# EAGLE design Dimmer2_RevA (EAGLE 7.4.0)
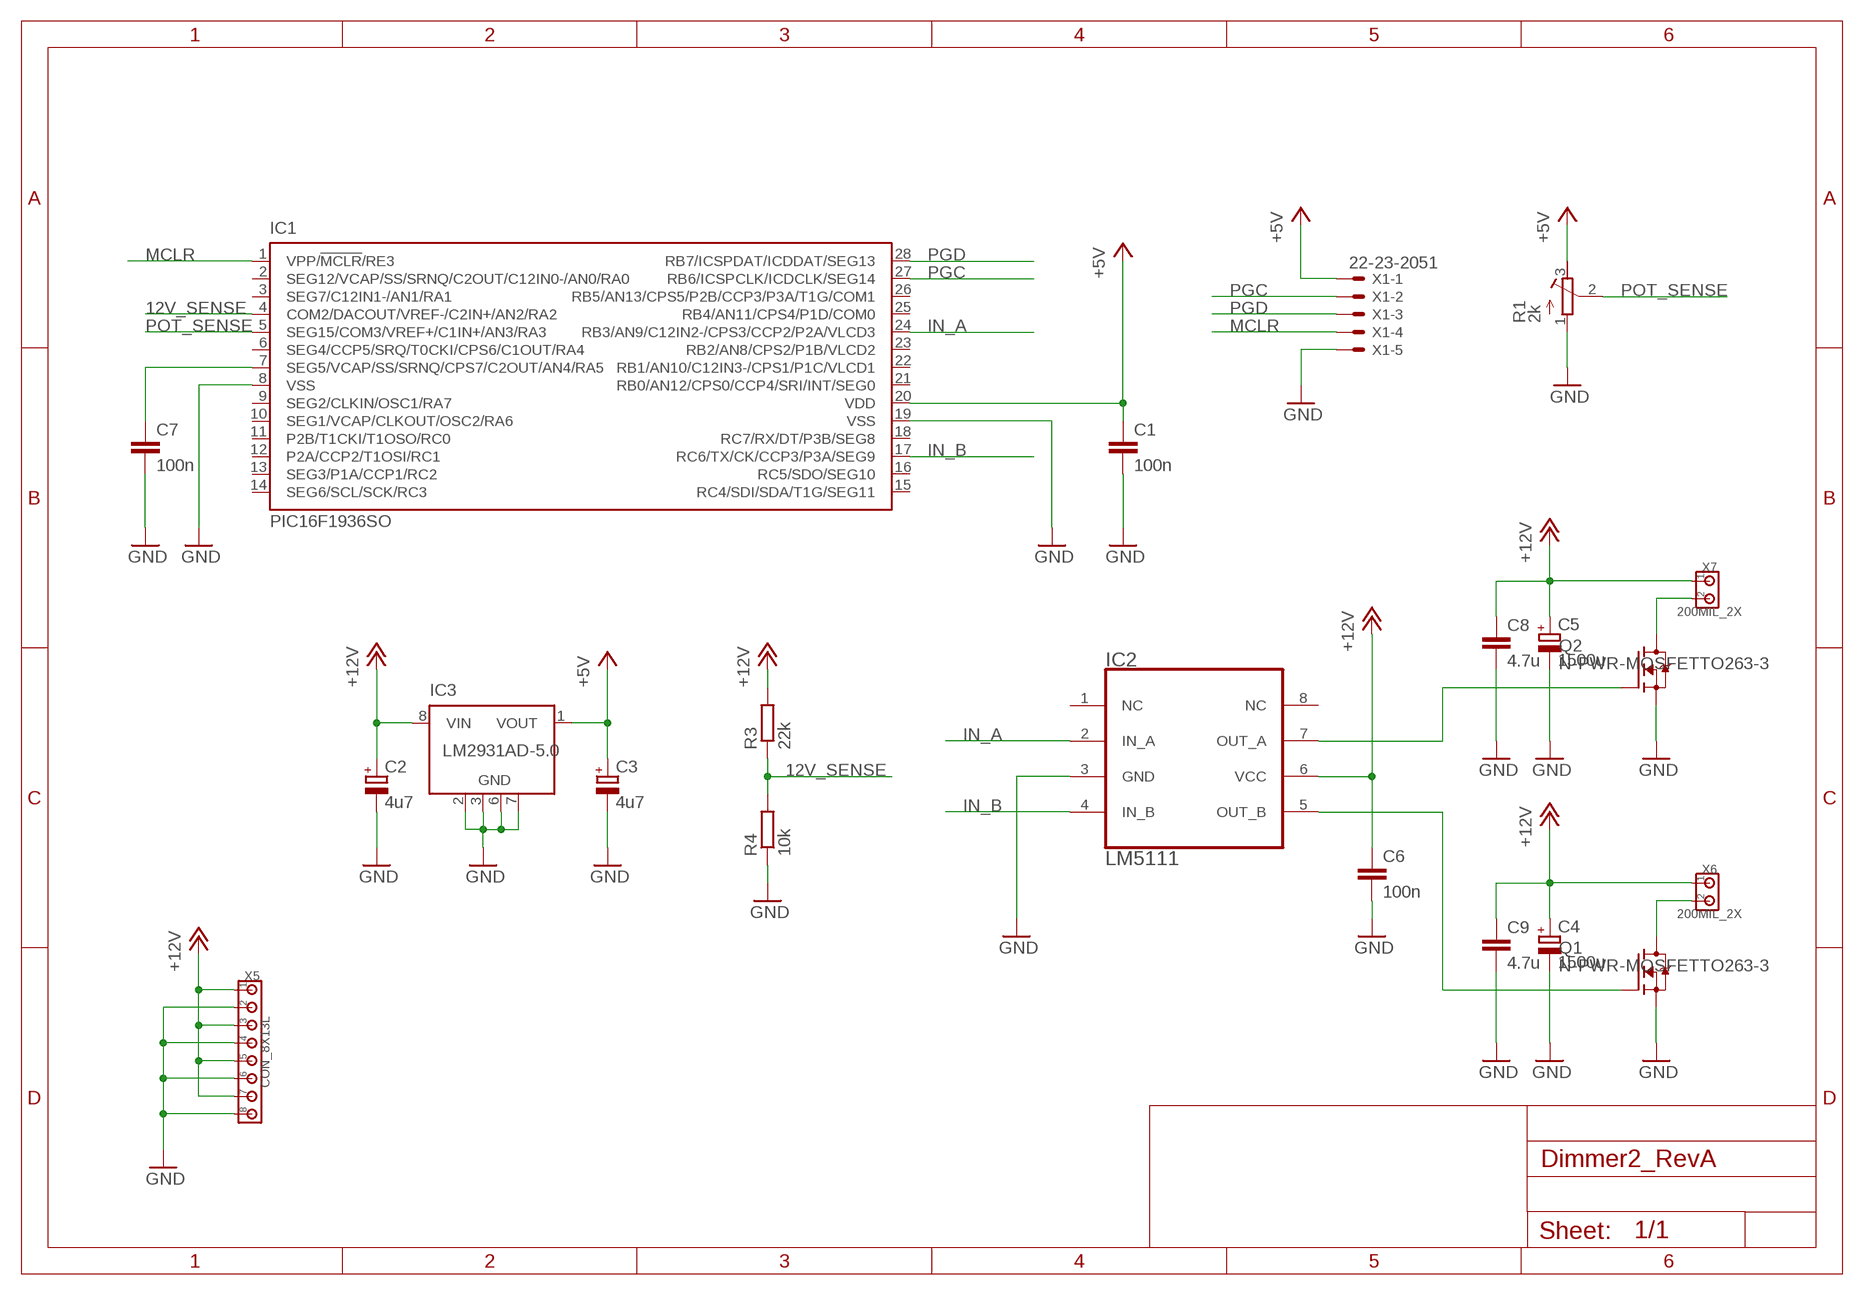
[diagram p0: schematic, sheet 1]

## Parts
C1  100n  CC0805  [C0805]
C2  4u7  C_POLARIZEDSMC_C  [SMC_C]
C3  4u7  C_POLARIZEDSMC_C  [SMC_C]
C4  1500u  C_POLARIZED10MM  [10MM]
C5  1500u  C_POLARIZED10MM  [10MM]
C6  100n  CC0805  [C0805]
C7  100n  CC0805  [C0805]
C8  4.7u  CC1206  [C1206]
C9  4.7u  CC1206  [C1206]
IC1  PIC16F1936SO  [SO28W]
IC2  LM5111  [SOIC8]
IC3  LM2931AD-5.0  [SO8]
Q1  N-PWR-MOSFETTO263-3  [TO263-3]
Q2  N-PWR-MOSFETTO263-3  [TO263-3]
R1  2k  TRIMMER  [CONTELEC]
R3  22k  RESISTORR0805  [R0805]
R4  10k  RESISTORR0805  [R0805]
X1  22-23-2051  [22-23-2051]
X5  CON_8X13L  [200MIL_8X]
X6  200MIL_2X  [200MIL_2X]
X7  200MIL_2X  [200MIL_2X]

## Nets
12V_SENSE: IC1.4(COM2/DACOUT/VREF-/C2IN+/AN2/RA2) R3.1 R4.2
+5V: C1.1 C3.+ IC1.20(VDD) IC3.1(VOUT) R1.3(CW) X1.1
+12V: C2.+ C4.+ C5.+ C6.1 C8.1 C9.1 IC2.6(VCC) IC3.8(VIN) R3.2 X5.1 X5.3 X5.5 X5.7 X6.1 X7.1
GND: C1.2 C2.- C3.- C4.- C5.- C6.2 C7.2 C8.2 C9.2 IC1.8(VSS) IC1.19(VSS) IC2.3(GND) IC3.2(GND) IC3.3(GND) IC3.6(GND) IC3.7(GND) Q1.3(S) Q2.3(S) R1.1(CCW) R4.1 X1.5 X5.2 X5.4 X5.6 X5.8
IN_A: IC1.24(RB3/AN9/C12IN2-/CPS3/CCP2/P2A/VLCD3) IC2.2(IN_A)
IN_B: IC1.17(RC6/TX/CK/CCP3/P3A/SEG9) IC2.4(IN_B)
MCLR: IC1.1(VPP/!MCLR!/RE3) X1.4
N$1: IC2.5(OUT_B) Q1.1(G)
N$2: Q1.TAB(D) X6.2
N$4: Q2.TAB(D) X7.2
N$5: C7.1 IC1.7(SEG5/VCAP/SS/SRNQ/CPS7/C2OUT/AN4/RA5)
N$6: IC2.7(OUT_A) Q2.1(G)
PGC: IC1.27(RB6/ICSPCLK/ICDCLK/SEG14) X1.2
PGD: IC1.28(RB7/ICSPDAT/ICDDAT/SEG13) X1.3
POT_SENSE: IC1.5(SEG15/COM3/VREF+/C1IN+/AN3/RA3) R1.2(WIPER)
Unconnected: IC1.2(SEG12/VCAP/SS/SRNQ/C2OUT/C12IN0-/AN0/RA0) IC1.3(SEG7/C12IN1-/AN1/RA1) IC1.6(SEG4/CCP5/SRQ/T0CKI/CPS6/C1OUT/RA4) IC1.9(SEG2/CLKIN/OSC1/RA7) IC1.10(SEG1/VCAP/CLKOUT/OSC2/RA6) IC1.11(P2B/T1CKI/T1OSO/RC0) IC1.12(P2A/CCP2/T1OSI/RC1) IC1.13(SEG3/P1A/CCP1/RC2) IC1.14(SEG6/SCL/SCK/RC3) IC1.15(RC4/SDI/SDA/T1G/SEG11) IC1.16(RC5/SDO/SEG10) IC1.18(RC7/RX/DT/P3B/SEG8) IC1.21(RB0/AN12/CPS0/CCP4/SRI/INT/SEG0) IC1.22(RB1/AN10/C12IN3-/CPS1/P1C/VLCD1) IC1.23(RB2/AN8/CPS2/P1B/VLCD2) IC1.25(RB4/AN11/CPS4/P1D/COM0) IC1.26(RB5/AN13/CPS5/P2B/CCP3/P3A/T1G/COM1) IC2.1(NC)

## Power pins joined to a net without a drawn wire
NC: IC2.8(NC)

## Library data of the parts
C1 C6-C9 = 00Capacitor:C: Capacitor
C2-C5 = 00Capacitor:C_POLARIZED
IC1 = 00PIC:PIC16F19*: Flash-Based, 8-Bit CMOS Microcontroller; EEPROM: 256; FLASH: 8192; RAM: 512
IC2 = 00Logic:LM5111
IC3 = 00VoltageRegulator:LM2931*
Q1 Q2 = 00Mosfet:N-PWR-MOSFET
R1 = 00Resistor:TRIMMER
R3 R4 = 00Resistor:RESISTOR: RESISTOR, European symbol
X1 = 00Connector:22-23-2051: .100" (2.54mm) Center Header - 5 Pin; MF: MOLEX; MPN: 22-23-2051; OC_FARNELL: 1462952; OC_NEWARK: 38C9178
X5 = 00Connector:CON_8X: 8-pin header
X6 X7 = 00Connector:200MIL_2X

## Board
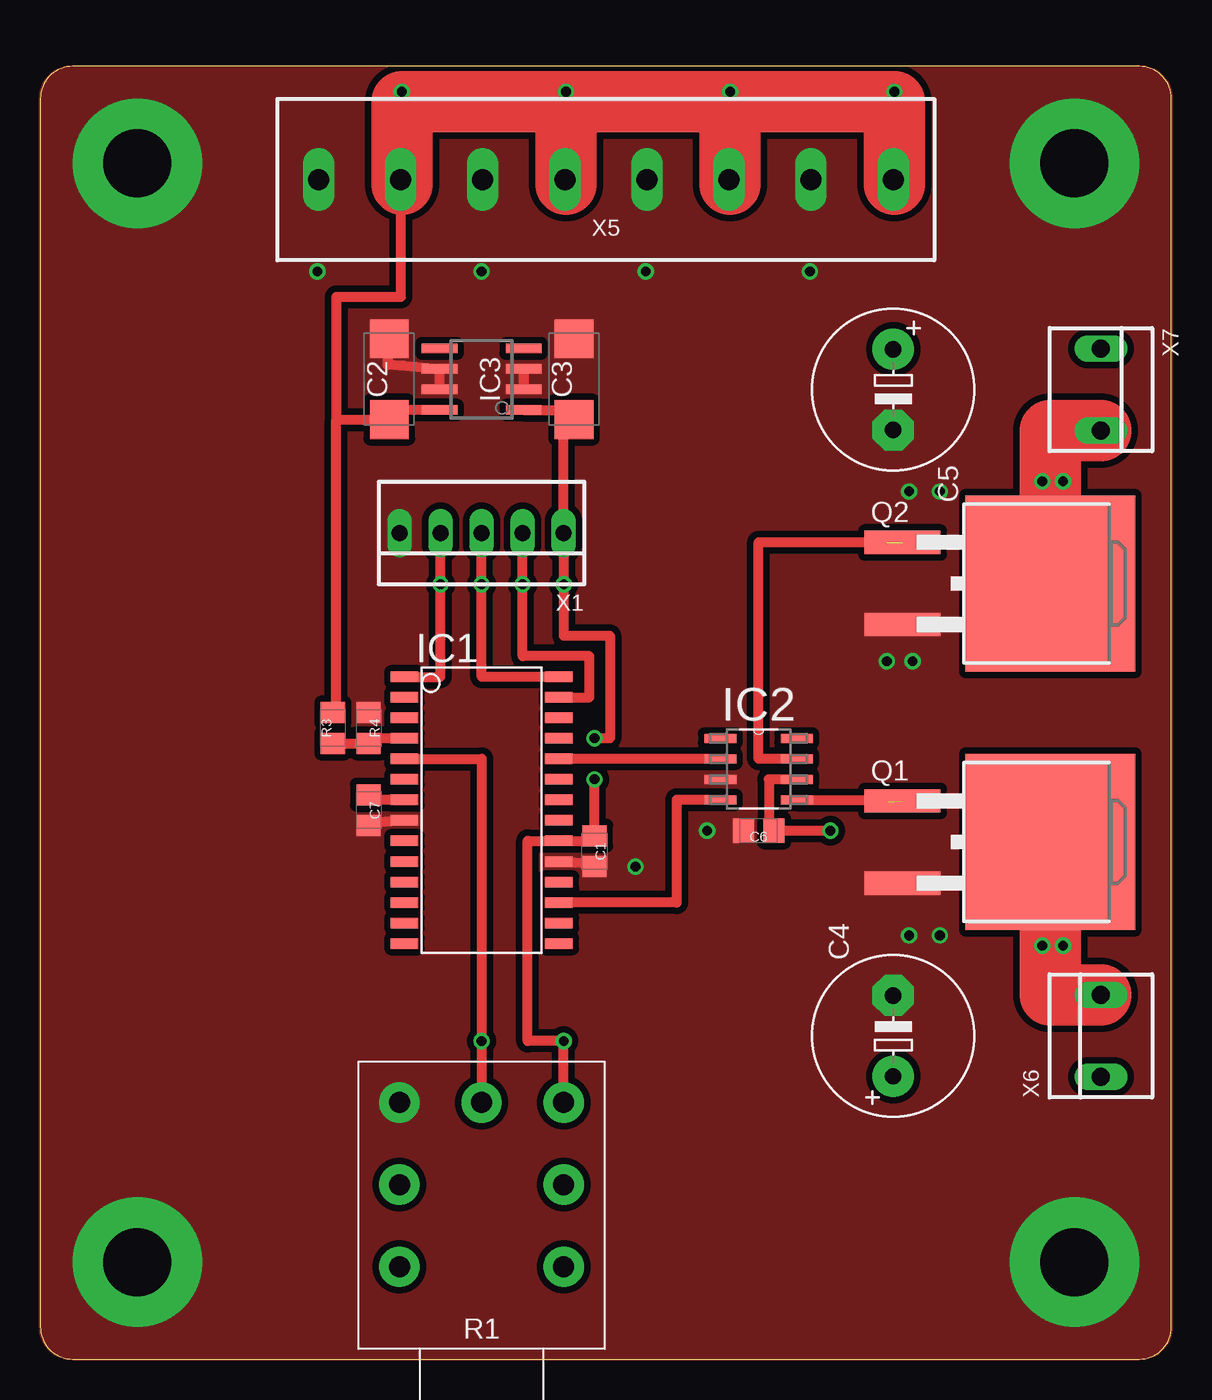
[diagram p1: board, top side]
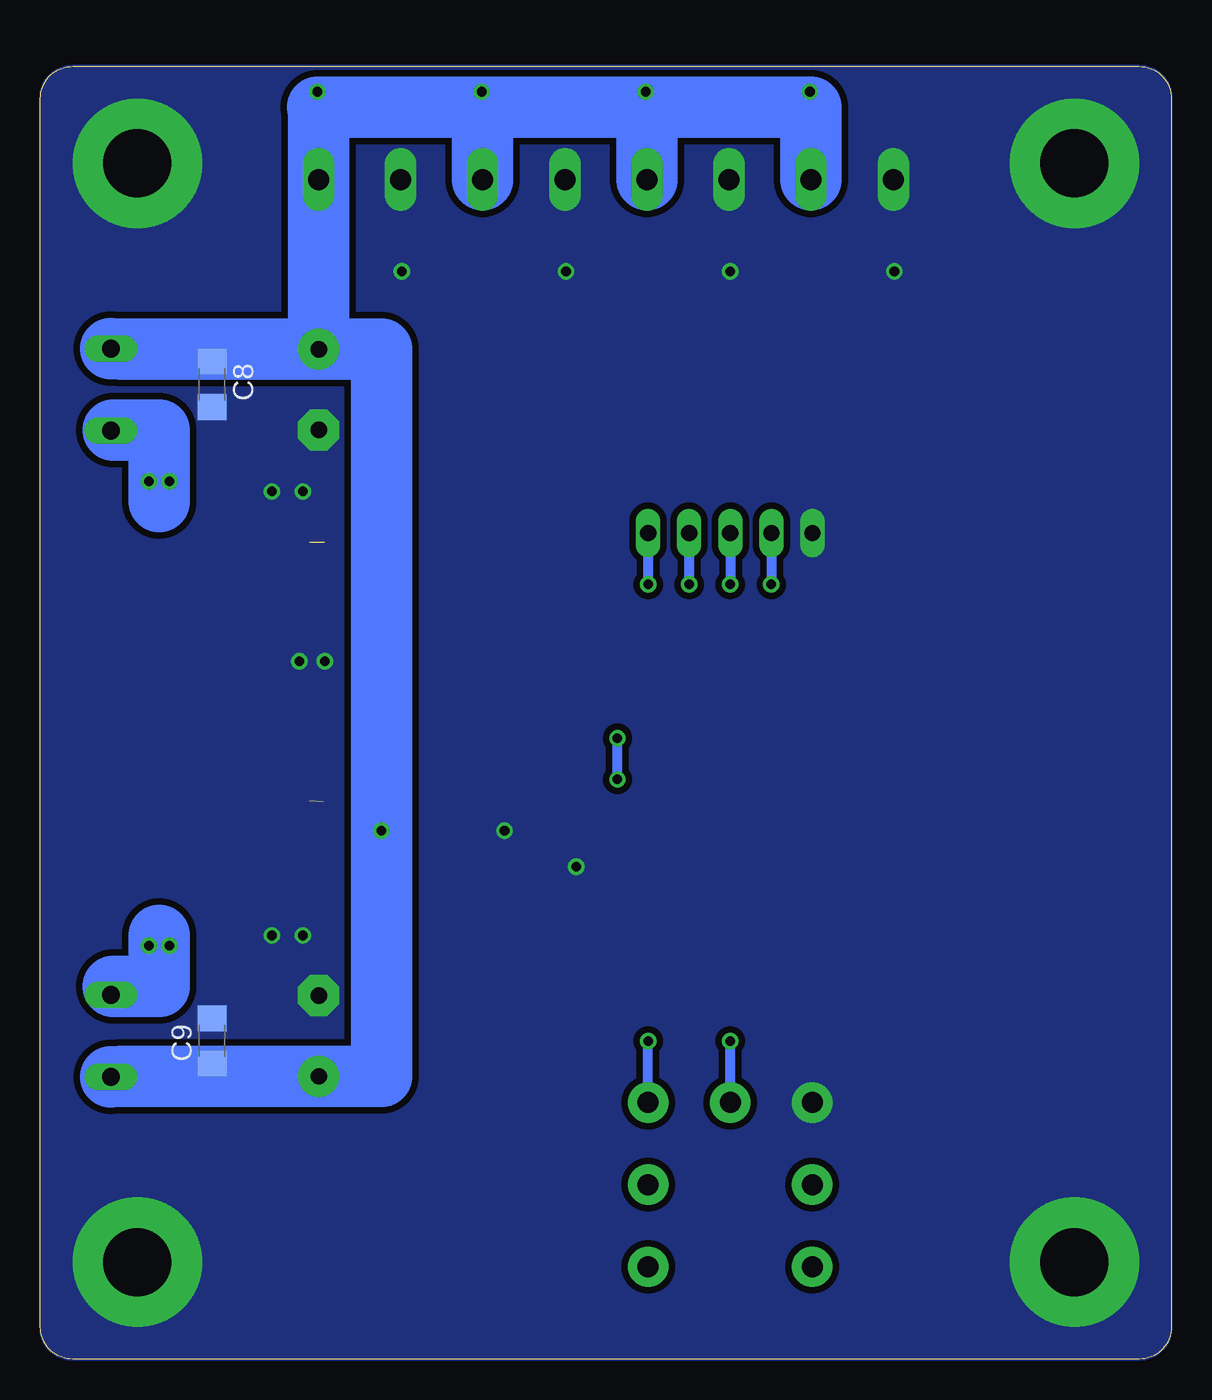
[diagram p2: board, bottom side, seen from below]

Size 70 x 80 mm. Coordinates in mm from the lower left corner, seen from the top.
Outline: 68,0 arc90 70,2 70,78 arc90 68,80 2,80 arc90 0,78 0,2 arc90 2,0 68,0
Copper layers (1*16): Top 0.035mm / dielectric 1.5mm / Bottom 0.035mm
Design rules "default *": minimum track width 10mil, minimum drill 24mil, track to track 8mil, track to pad 8mil, pad to pad 8mil, via to via 8mil, smd to smd 8mil, copper to edge 0mil, drill to drill 8mil, minimum pad ring 10mil, minimum via ring 8mil, stop-mask expansion 4mil, vias tented up to drill 0mil, thermal gap 10mil

### Footprints (pad centres in the part's own frame; a part is rotated, then mirrored left to right if it is on the bottom)
C0805 = smd 1.3 x 1.5: 1 -0.95,0; 2 0.95,0
SMC_C = smd 2.4 x 2.4: + -2.5,0; - 2.5,0
10MM = drill 1.016 pad 2.54: + -2.5,0 | drill 1.016 pad 2.54 octagon: - 2.5,0
C1206 = smd 1.6 x 1.8: 1 -1.4,0; 2 1.4,0
SO28W = smd 0.65 x 1.7: 1 -7.62,-4.78; 2 -6.35,-4.78; 3 -5.08,-4.78; 4 -3.81,-4.78; 5 -2.54,-4.78; 6 -1.27,-4.78; 7 0,-4.78; 8 1.27,-4.78; 9 2.54,-4.78; 10 3.81,-4.78; 11 5.08,-4.78; 12 6.35,-4.78; 13 7.62,-4.78; 14 8.89,-4.78; 15 8.89,4.78; 16 7.62,4.78; 17 6.35,4.78; 18 5.08,4.78; 19 3.81,4.78; 20 2.54,4.78; 21 1.27,4.78; 22 0,4.78; 23 -1.27,4.78; 24 -2.54,4.78; 25 -3.81,4.78; 26 -5.08,4.78; 27 -6.35,4.78; 28 -7.62,4.78
SOIC8 = smd 1.981 x 0.559: 1 -2.362,1.905; 2 -2.362,0.635; 3 -2.362,-0.635; 4 -2.362,-1.905; 5 2.362,-1.905; 6 2.362,-0.635; 7 2.362,0.635; 8 2.362,1.905
SO8 = smd 2.2 x 0.6: 1 -2.6,1.905; 2 -2.6,0.635; 3 -2.6,-0.635; 4 -2.6,-1.905; 5 2.6,-1.905; 6 2.6,-0.635; 7 2.6,0.635; 8 2.6,1.905
TO263-3 = smd 1.45 x 4.7: 1 -2.54,-5.65; 3 2.54,-5.65 | smd 10.9 x 10.5: TAB 0,3.5
CONTELEC = drill 1.3 pad 2.5: 1 -5.08,5.08; 2 0,5.08; 3 5.08,5.08; 4 -5.08,0; 5 -5.08,-5.08; 6 5.08,-5.08; 7 5.08,0
R0805 = smd 1.3 x 1.5: 1 -0.95,0; 2 0.95,0
22-23-2051 = drill 1 long: 1 -5.08,0; 2 -2.54,0; 3 0,0; 4 2.54,0; 5 5.08,0
200MIL_8X = drill 1.3 long: 1 -17.78,0; 2 -12.7,0; 3 -7.62,0; 4 -2.54,0; 5 2.54,0; 6 7.62,0; 7 12.7,0; 8 17.78,0
200MIL_2X = drill 1.1 long: 1 -2.54,0; 2 2.54,0

### Placement (x,y rotation side)
C1  34.29,31.43 270 top
C2  21.59,60.64 90 top
C3  33.02,60.64 90 top
C4  52.78,20 90 top
C5  52.78,60 270 top
C6  44.45,32.7 180 top
C7  20.32,33.97 270 top
C8  59.37,60.33 270 bottom
C9  59.37,19.68 90 bottom
IC1  27.3,34.61 270 top
IC2  44.45,36.51 0 top
IC3  27.3,60.64 180 top
Q1  59,32 270 top
Q2  59,48 270 top
R1  27.3,10.79 0 top
R3  18.1,39.05 90 top
R4  20.32,39.05 270 top
X1  27.3,51.12 180 top
X5  35,73 180 top
X6  65.64,20 90 top
X7  65.64,60 270 top

### Tracks (layer width: path | path; a pad name or v marks a point on that pad's centre or on a via)
12V_SENSE
  Top 0.61: IC1.4 20.95,38.42 R4.2 R3.1
+5V  (via drill 0.6)
  Top 0.61: R1.3 v32.38,19.68 30.16,19.68 30.16,32.07 IC1.20 34.29,32.07 C1.1 v34.29,35.88 | v34.29,38.42 35.24,38.42 35.24,44.77 32.38,44.77 v32.38,47.94 X1.1 32.38,58.74 | IC3.1 32.38,58.74 | 32.38,58.74 33.34,58.74 C3.+
  Bottom 0.61: v34.29,35.88 v34.29,38.42 | X1.1 v32.38,47.94
+12V  (via drill 0.6)
  Top 0.61: R3.2 18.31,40.17 18.31,58.14 | IC2.6 45.09,35.88 45.09,32.7 C6.1 v48.9,32.7 | 21.49,58.3 C2.+ | IC3.8 21.59,58.74 C2.+ | 18.31,58.14 C2.+ | X5.7 22.3,65.72 18.31,65.72 18.31,58.14
  Bottom 0.406: v22.37,78.44 22.3,78.44 22.3,77.48 | v32.53,78.44 32.53,77.48 | v42.69,78.44 42.69,77.48 | v52.85,78.44 52.78,78.44 52.78,77.48
  Bottom 1.27: C9.1 59.37,17.82 59.69,17.5 | C8.1 59.37,62.5
  Bottom 3.81: X7.1 65,62.5 59.37,62.5 C5.+ | X6.1 65,17.5 59.69,17.5 C4.+ 48.9,17.5 v48.9,32.7 48.9,62.5 C5.+ | C5.+ X5.1 52.78,77.48 | 52.78,77.48 52.85,77.48 | 52.78,77.48 42.69,77.48 | 42.69,77.48 32.53,77.48 | 32.53,77.48 22.3,77.48 X5.7 | X5.5 32.46,77.41 arc-90 32.53,77.48 | X5.3 42.62,77.41 arc-90 42.69,77.48
GND  (via drill 0.6, 4.2 pad 8)
  Top 0.61: IC1.8 20.54,33.18 C7.2 | IC1.19 34.62,30.64 C1.2 | IC3.7 IC3.6 21.49,61.55 C2.- 21.49,63.38 | IC3.3 IC3.2
  other vias: 6,6 64,6 6,74 64,74 37.47,67.31 27.3,67.31 47.62,67.31 55.66,26.23 55.66,53.7 53.76,26.23 53.76,53.7 17.14,67.31 52.39,43.18 53.98,43.18 41.27,32.7 36.83,30.48
  pour Bottom (isolate 0.4, no thermals): 68,0 2,0 arc-90 0,2 0,78 arc-90 2,80 68,80 arc-90 70,78 70,2 arc-90
  pour Top (isolate 0.4, no thermals): 0,2 0,78 arc-90 2,80 68,80 arc-90 70,78 70,2 arc-90 68,0 2,0 arc-90
IN_A
  Top 0.61: IC2.2 IC1.24
IN_B
  Top 0.61: IC2.4 39.37,34.61 39.37,28.26 IC1.17
MCLR  (via drill 0.6)
  Top 0.61: IC1.1 24.77,42.23 v24.77,47.94 X1.4
  Bottom 0.61: X1.4 v24.77,47.94
N$1  (1 unrouted)
  Top 0.61: 52.49,34.48 52.49,34.54 52.4,34.54 52.4,34.61 IC2.5
N$2  (via drill 0.6)
  Top 0.61: 62.5,22.54 62.5,25.59 v62.02,25.59
  Top 3.81: Q1.TAB 62.5,22.54 X6.2
  Bottom 0.61: v63.28,25.59 v62.02,25.59
N$3
  Bottom 0.61: 27.3,15.88 27.3,19.68
N$4  (via drill 0.6)
  Top 0.61: v63.28,54.33 v62.02,54.33 62.02,55.6 62.5,55.6
  Top 3.81: Q2.TAB 62.5,55.6 62.5,57.46 X7.2
N$5
  Top 0.61: IC1.7 20.32,34.61 C7.1
N$6  (1 unrouted)
  Top 0.61: IC2.7 44.45,37.15 44.45,50.54 52.4,50.54
N$7
  Bottom 0.61: 32.38,15.88 32.38,19.68
N$8
  Top 3.81: 22.37,72.72 22.37,77.8 32.53,77.8 | 32.53,77.8 42.69,77.8 | 42.69,77.8 52.85,77.8 52.85,72.72 | 32.53,77.8 32.53,72.72 | 42.69,77.8 42.69,72.72
N$9
  Bottom 3.81: 65.51,23.05 62.65,23.05 62.65,26.23
N$10
  Bottom 3.81: 65.51,57.51 62.65,57.51 62.65,53.06
PGC  (via drill 0.6)
  Top 0.61: IC1.27 33.97,40.96 33.97,43.5 29.84,43.5 v29.84,47.94 X1.2
  Bottom 0.61: X1.2 v29.84,47.94
PGD  (via drill 0.6)
  Top 0.61: IC1.28 27.3,42.23 v27.3,47.94 X1.3
  Bottom 0.61: X1.3 v27.3,47.94
POT_SENSE  (via drill 0.6)
  Top 0.61: IC1.5 27.3,37.15 v27.3,19.68 R1.2

### Text on the board
tText: Lukas Fässler 2015